# EAGLE design f4mpac (EAGLE 7.5.0)
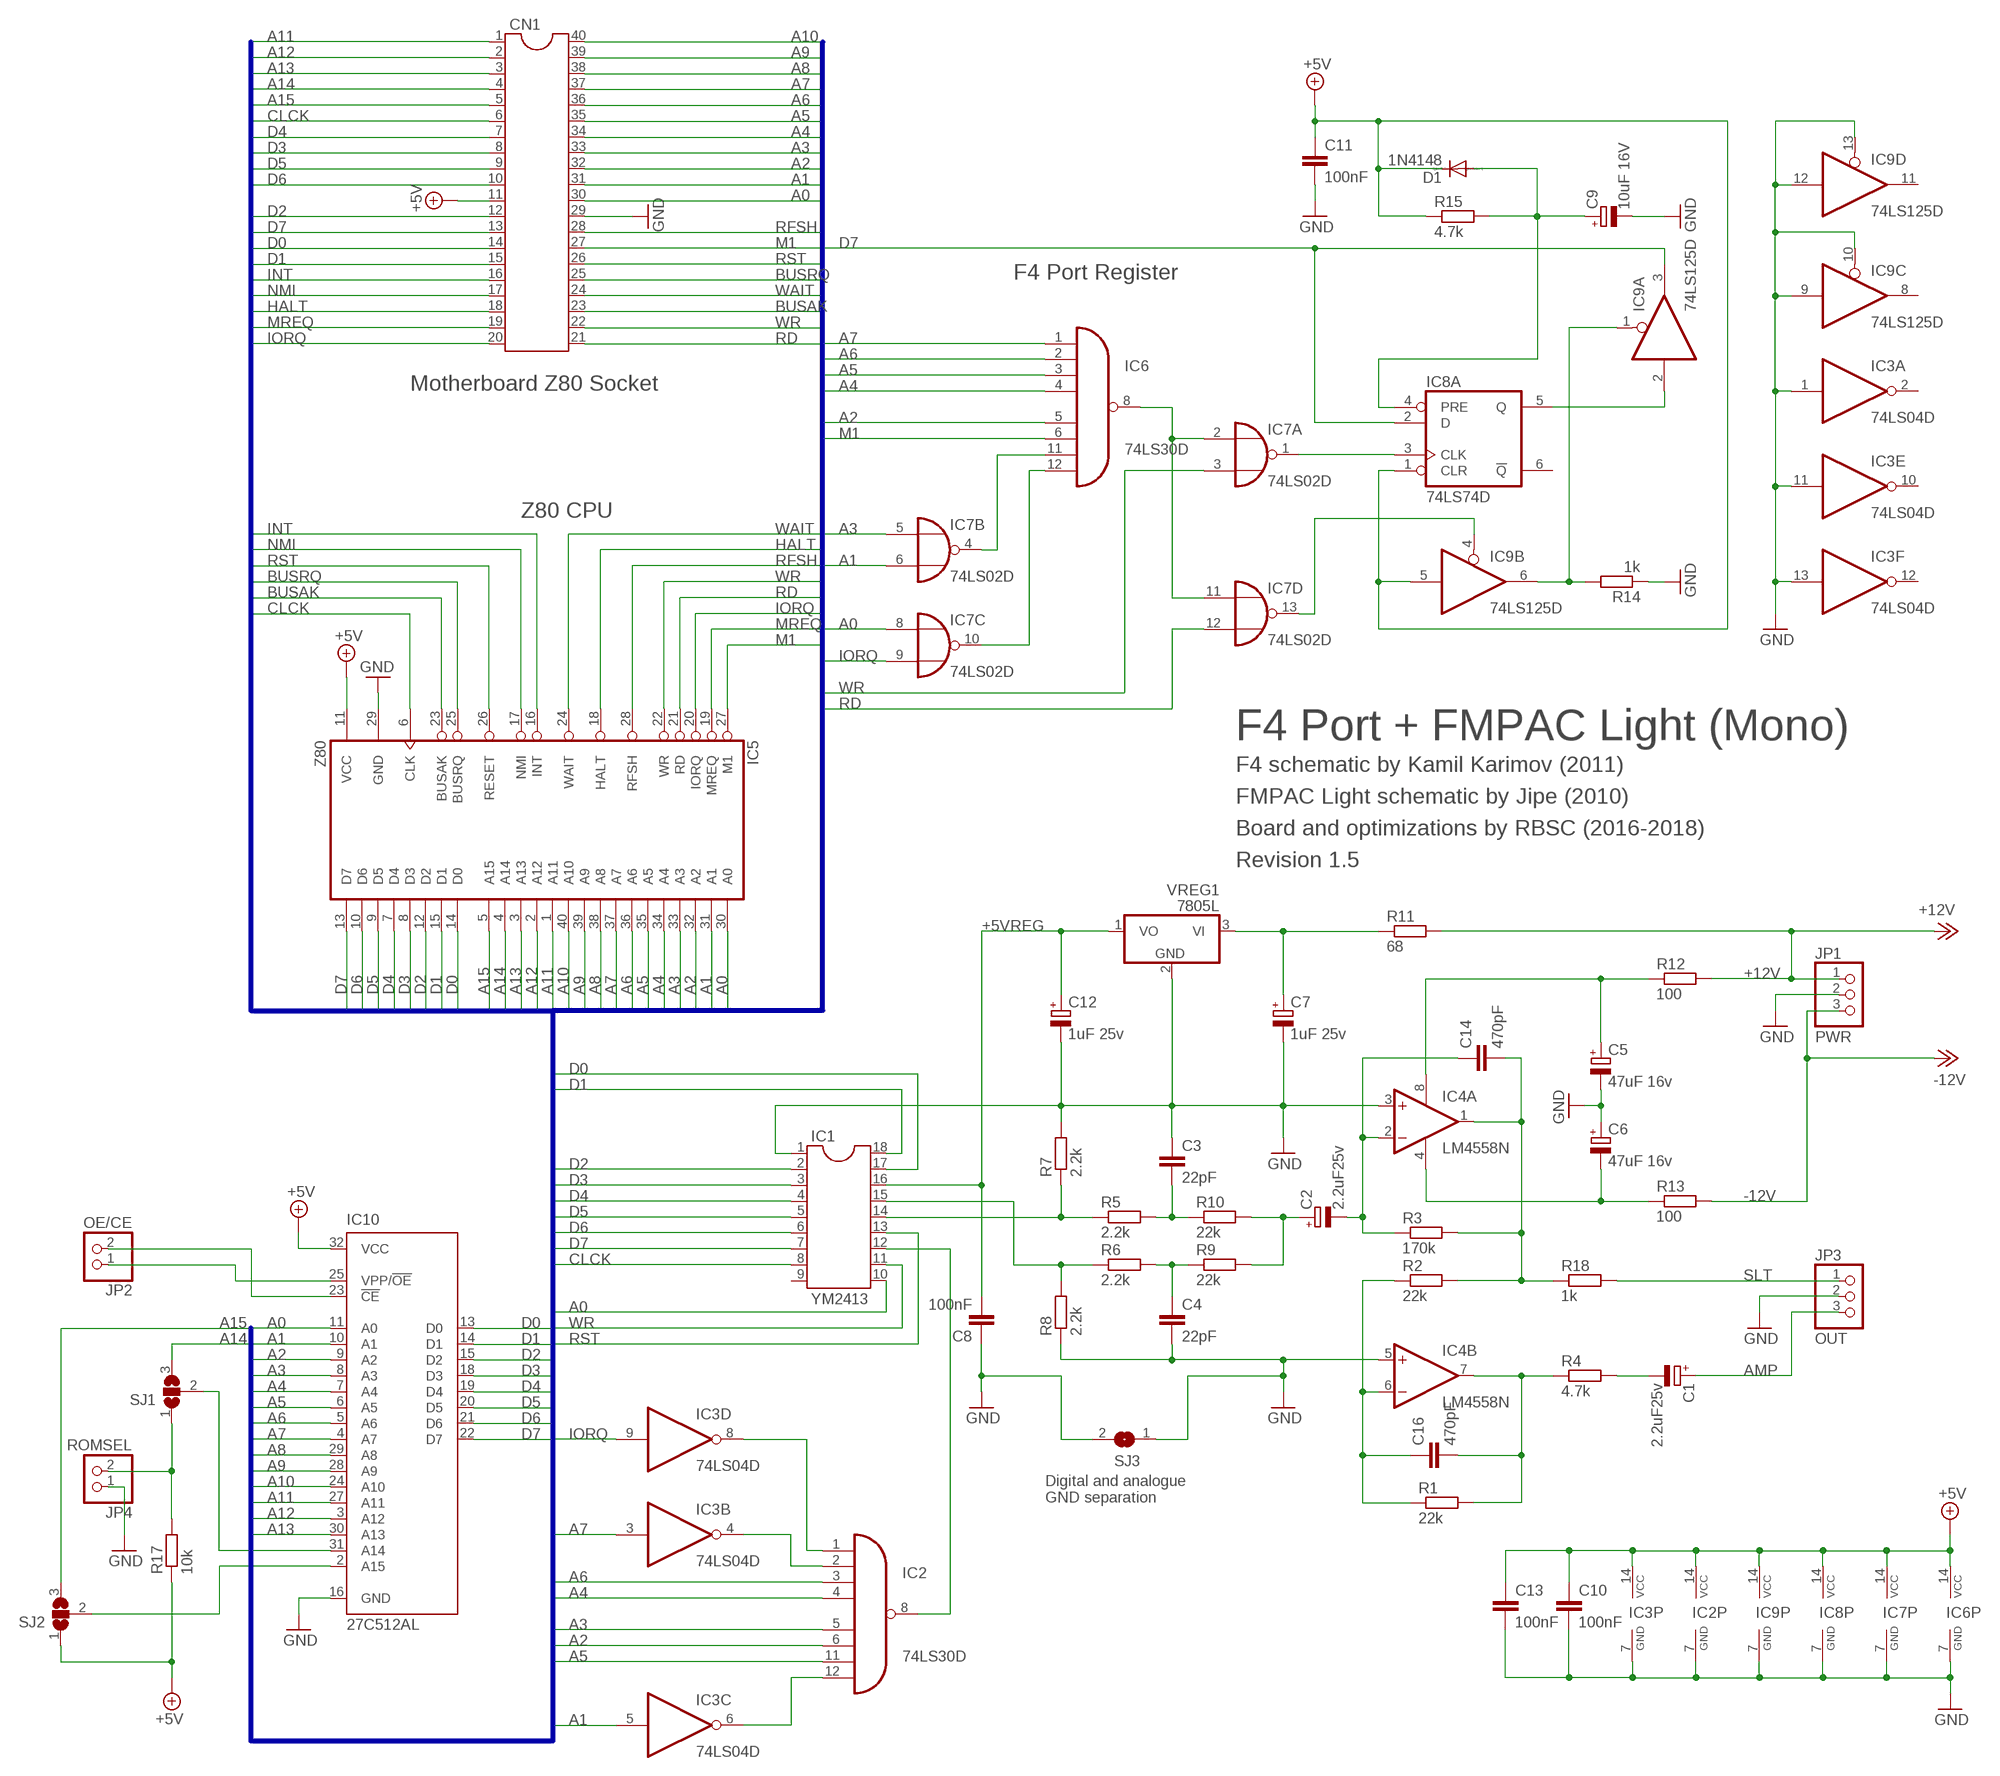
[diagram p0: schematic, sheet 1]

## Parts
C1  2.2uF25v  CPOL-EUSMCB  [SMC_B]
C2  2.2uF25v  CPOL-EUSMCB  [SMC_B]
C3  22pF  C-EUC0805  [C0805]
C4  22pF  C-EUC0805  [C0805]
C5  47uF 16v  CPOL-EUSMCC  [SMC_C]
C6  47uF 16v  CPOL-EUSMCC  [SMC_C]
C7  1uF 25v  CPOL-EUSMCB  [SMC_B]
C8  100nF  C-EUC0805  [C0805]
C9  10uF 16V  CPOL-EUSMCB  [SMC_B]
C10  100nF  C-EUC0805  [C0805]
C11  100nF  C-EUC0805  [C0805]
C12  1uF 25v  CPOL-EUSMCB  [SMC_B]
C13  100nF  C-EUC0805  [C0805]
C14  470pF  C-EUC0805  [C0805]
C16  470pF  C-EUC0805  [C0805]
CN1  DIP40 MB CONN  DIL40  [DIL40]
D1  1N4148  DIODE-MINIMELF  [MINIMELF]
IC1  YM2413  DIL18  [DIL18]
IC2  74LS30D  [SO14]
IC3  74LS04D  [SO14]
IC4  LM4558N  [DIL08]
IC5  Z80  Z80CPU  [DIL40]
IC6  74LS30D  [SO14]
IC7  74LS02D  [SO14]
IC8  74LS74D  [SO14]
IC9  74LS125D  [SO14]
IC10  27C512AL  [PLCC-32]
JP1  PWR  PINHD-1X3/90  [1X03/90]
JP2  OE/CE  PINHD-1X2/90  [1X02/90]
JP3  OUT  PINHD-1X3/90  [1X03/90]
JP4  ROMSEL  PINHD-1X2/90  [1X02/90]
R1  22k  R-EU_R0805  [R0805]
R2  22k  R-EU_R0805  [R0805]
R3  170k  R-EU_R0805  [R0805]
R4  4.7k  R-EU_R0805  [R0805]
R5  2.2k  R-EU_R0805  [R0805]
R6  2.2k  R-EU_R0805  [R0805]
R7  2.2k  R-EU_R0805  [R0805]
R8  2.2k  R-EU_R0805  [R0805]
R9  22k  R-EU_R0805  [R0805]
R10  22k  R-EU_R0805  [R0805]
R11  68  R-EU_R0805  [R0805]
R12  100  R-EU_R0805  [R0805]
R13  100  R-EU_R0805  [R0805]
R14  1k  R-EU_R0805  [R0805]
R15  4.7k  R-EU_M0805  [M0805]
R17  10k  R-EU_R0805  [R0805]
R18  1k  R-EU_R0805  [R0805]
SJ1  SJ2W  [SJ_2]
SJ2  SJ2W  [SJ_2]
SJ3  SJ  [SJ]
VREG1  7805L  [TO92]

## Nets
+5V: C10.1 C11.1 C13.1 CN1.11 D1.C IC2.14(VCC) IC3.14(P:VCC) IC5.11(VCC) IC6.14(VCC) IC7.14(P:VCC) IC8.1(A:CLR) IC8.14(P:VCC) IC9.5(B:I) IC9.14(P:VCC) IC10.32(VCC) R15.1 R17.1 SJ2.1
+5VREG: C8.2 C12.+ IC1.16 VREG1.1(VO)
+12V: JP1.1 R11.2 R12.2
+12VAMP: C5.+ IC4.8(P:V+) R12.1
-12V: JP1.3 R13.2
-12VAMP: C6.- IC4.4(P:V-) R13.1
A0: CN1.30 IC1.10 IC5.30(A0) IC7.8(C:I0) IC10.11(A0)
A1: CN1.31 IC3.5(C:I) IC5.31(A1) IC7.6(B:I1) IC10.10(A1)
A2: CN1.32 IC2.6(I5) IC5.32(A2) IC6.5(I4) IC10.9(A2)
A3: CN1.33 IC2.5(I4) IC5.33(A3) IC7.5(B:I0) IC10.8(A3)
A4: CN1.34 IC2.4(I3) IC5.34(A4) IC6.4(I3) IC10.7(A4)
A5: CN1.35 IC2.11(I6) IC5.35(A5) IC6.3(I2) IC10.6(A5)
A6: CN1.36 IC2.3(I2) IC5.36(A6) IC6.2(I1) IC10.5(A6)
A7: CN1.37 IC3.3(B:I) IC5.37(A7) IC6.1(I0) IC10.4(A7)
A8: CN1.38 IC5.38(A8) IC10.29(A8)
A9: CN1.39 IC5.39(A9) IC10.28(A9)
A10: CN1.40 IC5.40(A10) IC10.24(A10)
A11: CN1.1 IC5.1(A11) IC10.27(A11)
A12: CN1.2 IC5.2(A12) IC10.3(A12)
A13: CN1.3 IC5.3(A13) IC10.30(A13)
A14: CN1.4 IC5.4(A14) SJ1.3
A15: CN1.5 IC5.5(A15) SJ2.3
AMP: C1.+ JP3.3
BUSAK: CN1.23 IC5.23(BUSAK)
BUSRQ: CN1.25 IC5.25(BUSRQ)
CLCK: CN1.6 IC1.8 IC5.6(CLK)
D0: CN1.14 IC1.17 IC5.14(D0) IC10.13(D0)
D1: CN1.15 IC1.18 IC5.15(D1) IC10.14(D1)
D2: CN1.12 IC1.2 IC5.12(D2) IC10.15(D2)
D3: CN1.8 IC1.3 IC5.8(D3) IC10.18(D3)
D4: CN1.7 IC1.4 IC5.7(D4) IC10.19(D4)
D5: CN1.9 IC1.5 IC5.9(D5) IC10.20(D5)
D6: CN1.10 IC1.6 IC5.10(D6) IC10.21(D6)
D7: CN1.13 IC1.7 IC5.13(D7) IC8.2(A:D) IC9.3(A:O) IC10.22(D7)
GND: C3.1 C4.2 C5.- C6.+ C7.- C8.1 C9.- C10.2 C11.2 C12.- C13.2 CN1.29 IC1.1 IC2.7(GND) IC3.1(A:I) IC3.7(P:GND) IC3.11(E:I) IC3.13(F:I) IC4.3(A:+IN) IC4.5(B:+IN) IC5.29(GND) IC6.7(GND) IC7.7(P:GND) IC8.7(P:GND) IC9.7(P:GND) IC9.9(C:I) IC9.10(C:OE) IC9.12(D:I) IC9.13(D:OE) IC10.16(GND) JP1.2 JP3.2 JP4.1 R7.2 R8.1 R14.1 SJ3.1 SJ3.2 VREG1.2(GND)
HALT: CN1.18 IC5.18(HALT)
INT: CN1.16 IC5.16(INT)
IORQ: CN1.20 IC3.9(D:I) IC5.20(IORQ) IC7.9(C:I1)
M1: CN1.27 IC5.27(M1) IC6.6(I5)
MREQ: CN1.19 IC5.19(MREQ)
N$1: IC1.12 IC2.8(O)
N$2: IC10.31(A14) SJ1.2
N$3: C7.+ R11.1 VREG1.3(VI)
N$6: IC1.14 R5.1 R7.1
N$7: C2.- C14.1 IC4.2(A:-IN) R3.1
N$9: C16.1 IC4.6(B:-IN) R1.1 R2.1
N$11: C1.- R4.2
N$12: C3.2 R5.2 R10.1
N$13: IC1.15 R6.1 R8.2
N$14: C4.1 R6.2 R9.1
N$15: IC2.12(I7) IC3.6(C:O)
N$16: C2.+ R9.2 R10.2
N$17: IC2.2(I1) IC3.4(B:O)
N$18: IC2.1(I0) IC3.8(D:O)
N$19: C9.+ D1.A IC8.4(A:PRE) R15.2
N$20: IC10.25(VPP/!OE) JP2.1
N$21: IC10.23(!CE) JP2.2
N$22: JP4.2 R17.2 SJ1.1
N$24: IC6.11(I6) IC7.4(B:O)
N$25: IC10.2(A15) SJ2.2
N$27: C16.2 IC4.7(B:OUT) R1.2 R4.1
N$30: IC6.12(I7) IC7.10(C:O)
N$31: IC7.1(A:O) IC8.3(A:CLK)
N$32: IC7.13(D:O) IC9.4(B:OE)
N$33: IC6.8(O) IC7.2(A:I0) IC7.11(D:I0)
N$38: IC9.1(A:OE) IC9.6(B:O) R14.2
N$40: C14.2 IC4.1(A:OUT) R2.2 R3.2 R18.1
N$41: IC8.5(A:Q) IC9.2(A:I)
NMI: CN1.17 IC5.17(NMI)
RD: CN1.21 IC5.21(RD) IC7.12(D:I1)
RFSH: CN1.28 IC5.28(RFSH)
RST: CN1.26 IC1.13 IC5.26(RESET)
SLT: JP3.1 R18.2
WAIT: CN1.24 IC5.24(WAIT)
WR: CN1.22 IC1.11 IC5.22(WR) IC7.3(A:I1)
Unconnected: IC1.9 IC3.2(A:O) IC3.10(E:O) IC3.12(F:O) IC8.6(A:!Q) IC8.8(B:!Q) IC8.9(B:Q) IC8.10(B:PRE) IC8.11(B:CLK) IC8.12(B:D) IC8.13(B:CLR) IC9.8(C:O) IC9.11(D:O)

## Buses
A0,A1,A2,A3,A4,A5,A6,A7,A8,A9,A10,A11,A12,A13,A14,A15,D0,D1,D2,D3,D4,D5,D6,D7,IORQ,RD,WR,M1,CLCK,RST,RFSH,BUSRQ,WAIT,BUSAK,MREQ,HALT,INT,NMI

## Notes on the sheet
- F4 Port Register
- Motherboard Z80 Socket
- Z80 CPU
- F4 Port + FMPAC Light (Mono)
- F4 schematic by Kamil Karimov (2011)
- FMPAC Light schematic by Jipe (2010)
- Board and optimizations by RBSC (2016-2018)
- Revision 1.5
- Digital and analogue
  GND separation

## Library data of the parts
C1 C2 C5-C7 C9 C12 = rcl:CPOL-EU: POLARIZED CAPACITOR, European symbol
C3 C4 C8 C10 C11 C13 C14 C16 = rcl:C-EU: CAPACITOR, European symbol
CN1 = ic-package:DIL40: Dual In Line
D1 = diode:DIODE-: DIODE
IC1 = ic-package:DIL18: Dual In Line / Socket
IC2 IC6 = 74xx-eu:74*30: 8-input NAND gate
IC3 = 74xx-eu:74*04: Hex INVERTER
IC4 = linear:*4558: OP AMP
IC5 = zilog:Z80CPU: Z80 FAMILY DEVICE
IC7 = 74xx-eu:74*02: Quad 2-input NOR gate
IC8 = 74xx-eu:74*74: Dual D type positive edge triggered FLIP FLOP, preset and clear
IC9 = 74xx-eu:74*125: Quad bus BUFFER, 3-state
IC10 = microchip:27*512A: CMOS EPROM 512 K (64 K x 8); MPN: M27C512-90C1; OC_FARNELL: 1218315; OC_NEWARK: 24M5090
JP1 JP3 = pinhead:PINHD-1X3: PIN HEADER
JP2 JP4 = pinhead:PINHD-1X2: PIN HEADER
R1-R15 R17 R18 = rcl:R-EU_: RESISTOR, European symbol
SJ1 SJ2 = jumper:SJ2W: SMD solder JUMPER
SJ3 = jumper:SJ: SMD solder JUMPER
VREG1 = linear:78*: Positive VOLTAGE REGULATOR Source: http://cache.national.com/ds/LM/LM78L05.pdf http://www.fairchildsemi.com/ds/LM/LM7805.pdf

## Board
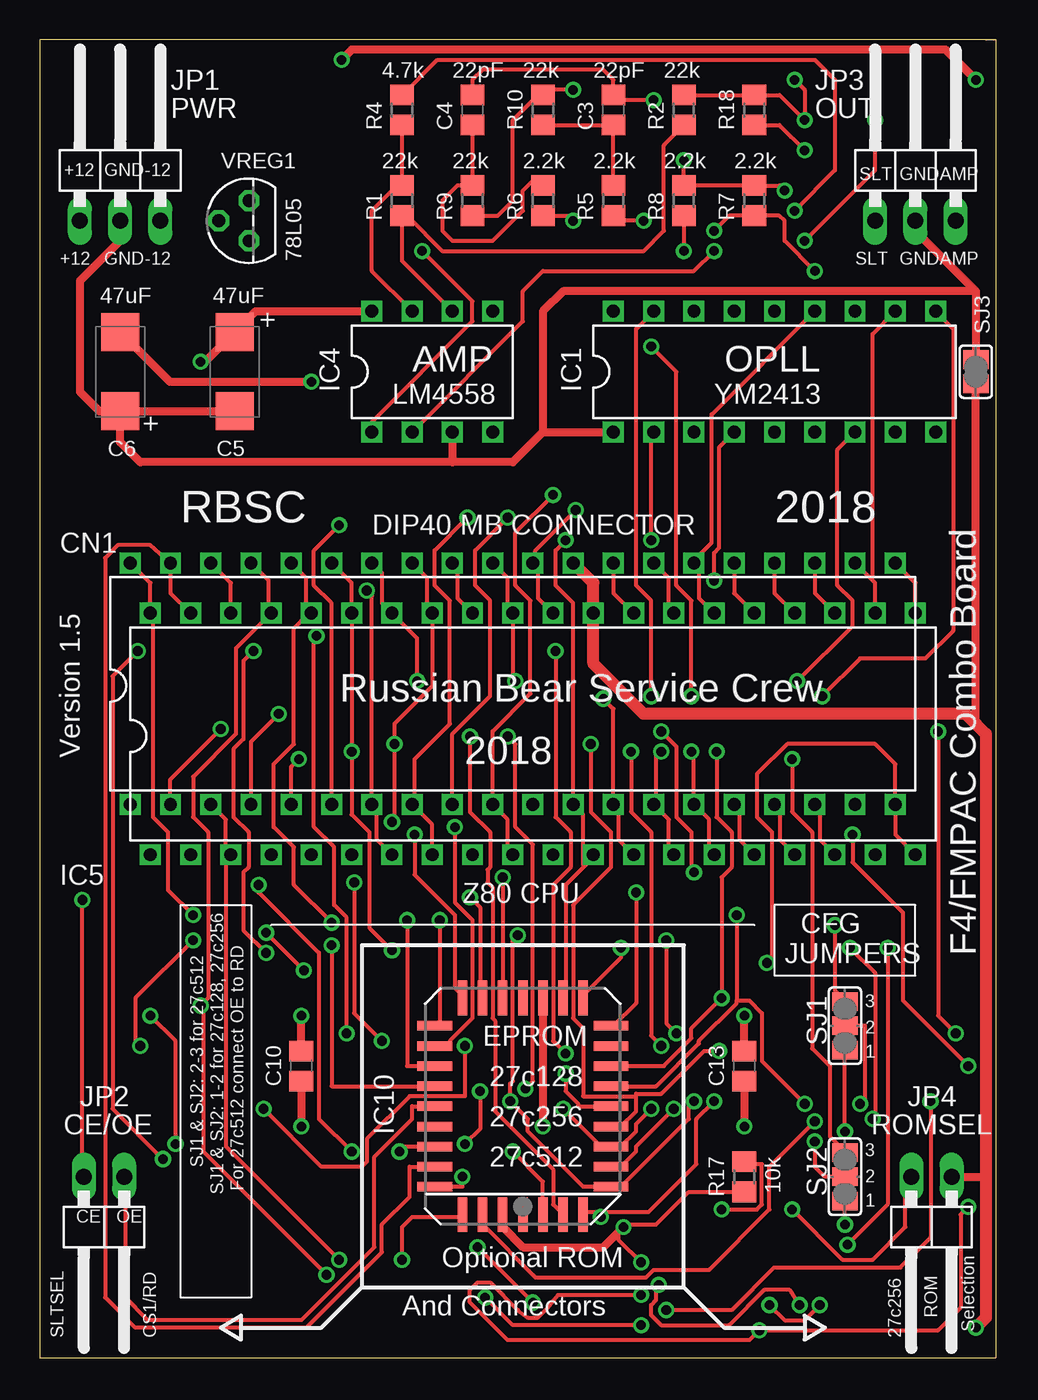
[diagram p1: board, top side]
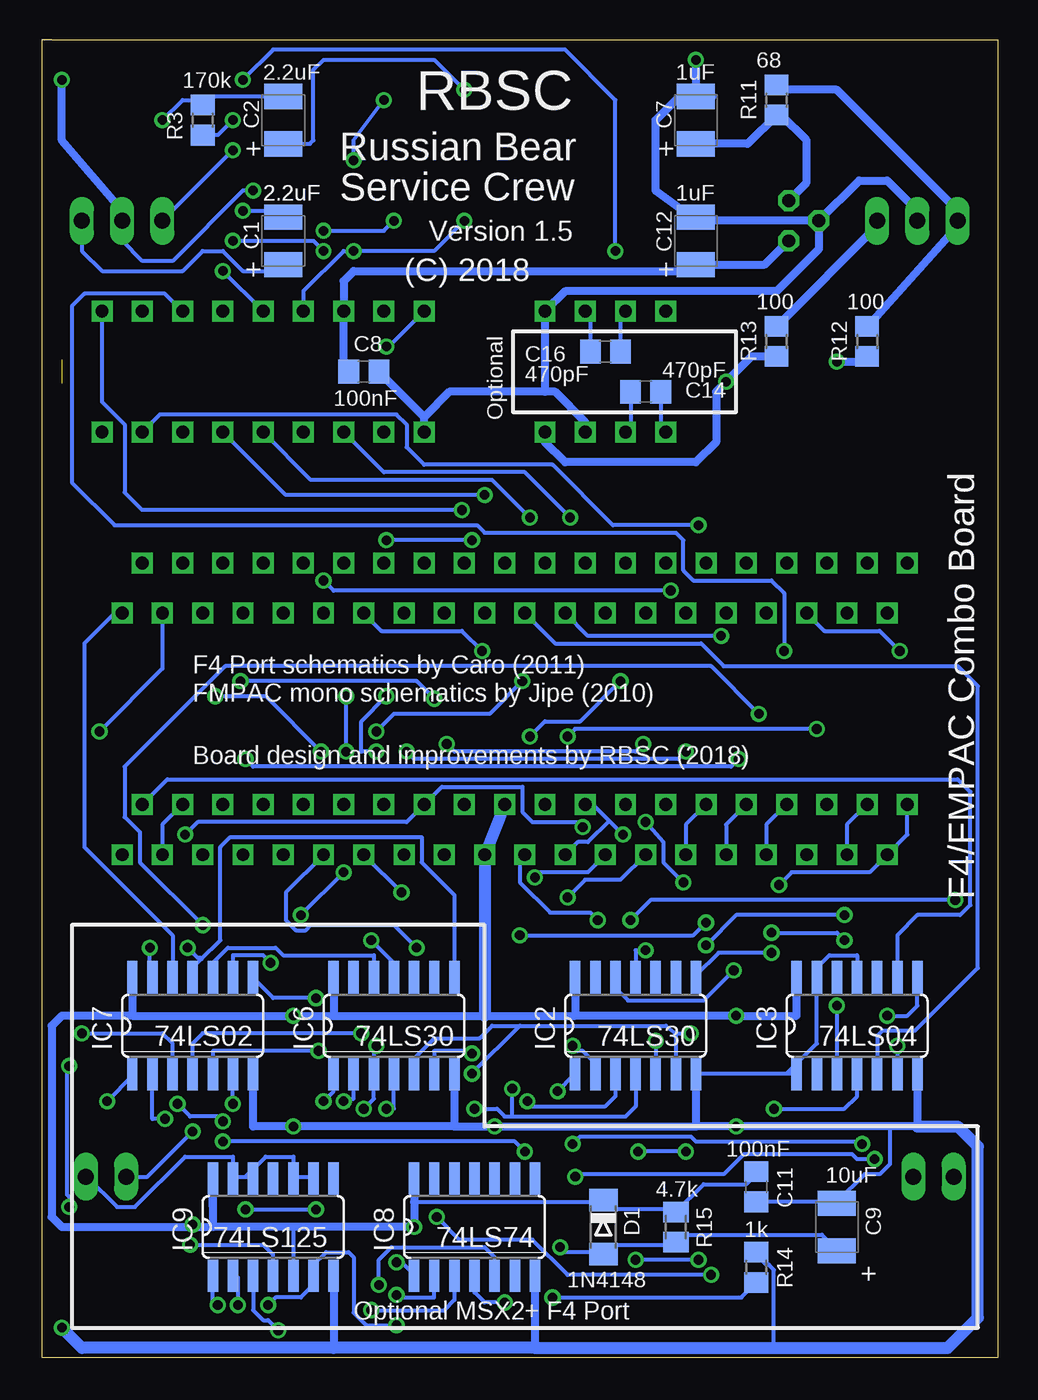
[diagram p2: board, bottom side, seen from below]

Size 60.33 x 83.19 mm. Coordinates in mm from the lower left corner, seen from the top.
Outline: 60.33,83.18 0,83.18 0,0 60.33,0 60.33,83.18
Outline: 59.69,83.19 60.33,83.18
Copper layers (1*16): Top 0.035mm / dielectric 1.5mm / Bottom 0.035mm
Design rules "default *": minimum track width 10mil, minimum drill 24mil, track to track 8mil, track to pad 8mil, pad to pad 8mil, via to via 8mil, smd to smd 8mil, copper to edge 8mil, drill to drill 8mil, minimum pad ring 10mil, minimum via ring 8mil, stop-mask expansion 4mil, vias tented up to drill 24mil, thermal gap 10mil

### Footprints (pad centres in the part's own frame; a part is rotated, then mirrored left to right if it is on the bottom)
SMC_B = smd 1.6 x 2.4: + -1.5,0; - 1.5,0
C0805 = smd 1.3 x 1.5: 1 -0.95,0; 2 0.95,0
SMC_C = smd 2.4 x 2.4: + -2.5,0; - 2.5,0
DIL40 = drill 0.813 square: 1 -24.13,-7.62; 2 -21.59,-7.62; 3 -19.05,-7.62; 4 -16.51,-7.62; 5 -13.97,-7.62; 6 -11.43,-7.62; 7 -8.89,-7.62; 8 -6.35,-7.62; 9 -3.81,-7.62; 10 -1.27,-7.62; 11 1.27,-7.62; 12 3.81,-7.62; 13 6.35,-7.62; 14 8.89,-7.62; 15 11.43,-7.62; 16 13.97,-7.62; 17 16.51,-7.62; 18 19.05,-7.62; 19 21.59,-7.62; 20 24.13,-7.62; 21 24.13,7.62; 22 21.59,7.62; 23 19.05,7.62; 24 16.51,7.62; 25 13.97,7.62; 26 11.43,7.62; 27 8.89,7.62; 28 6.35,7.62; 29 3.81,7.62; 30 1.27,7.62; 31 -1.27,7.62; 32 -3.81,7.62; 33 -6.35,7.62; 34 -8.89,7.62; 35 -11.43,7.62; 36 -13.97,7.62; 37 -16.51,7.62; 38 -19.05,7.62; 39 -21.59,7.62; 40 -24.13,7.62
MINIMELF = smd 1.4 x 1.8: A 1.7,0; C -1.7,0
DIL18 = drill 0.813 square: 1 -10.16,-3.81; 2 -7.62,-3.81; 3 -5.08,-3.81; 4 -2.54,-3.81; 5 0,-3.81; 6 2.54,-3.81; 7 5.08,-3.81; 8 7.62,-3.81; 9 10.16,-3.81; 10 10.16,3.81; 11 7.62,3.81; 12 5.08,3.81; 13 2.54,3.81; 14 0,3.81; 15 -2.54,3.81; 16 -5.08,3.81; 17 -7.62,3.81; 18 -10.16,3.81
SO14 = smd 0.66 x 2.032: 1 -3.81,-3.073; 2 -2.54,-3.073; 3 -1.27,-3.073; 4 0,-3.073; 5 1.27,-3.073; 6 2.54,-3.073; 7 3.81,-3.073; 8 3.81,3.073; 9 2.54,3.073; 10 1.27,3.073; 11 0,3.073; 12 -1.27,3.073; 13 -2.54,3.073; 14 -3.81,3.073
DIL08 = drill 0.813 pad 1.27 square: 1 -3.81,-3.81; 2 -1.27,-3.81; 3 1.27,-3.81; 4 3.81,-3.81; 5 3.81,3.81; 6 1.27,3.81; 7 -1.27,3.81; 8 -3.81,3.81
PLCC-32 = smd 2.2 x 0.6: 1 -6.83,0; 2 -6.83,-1.27; 3 -6.83,-2.54; 4 -6.83,-3.81; 14 6.83,-3.81; 15 6.83,-2.54; 16 6.83,-1.27; 17 6.83,0; 18 6.83,1.27; 19 6.83,2.54; 20 6.83,3.81; 30 -6.83,3.81; 31 -6.83,2.54; 32 -6.83,1.27 | smd 0.6 x 2.2: 5 -5.08,-5.56; 6 -3.81,-5.56; 7 -2.54,-5.56; 8 -1.27,-5.56; 9 0,-5.56; 10 1.27,-5.56; 11 2.54,-5.56; 12 3.81,-5.56; 13 5.08,-5.56; 21 5.08,5.56; 22 3.81,5.56; 23 2.54,5.56; 24 1.27,5.56; 25 0,5.56; 26 -1.27,5.56; 27 -2.54,5.56; 28 -3.81,5.56; 29 -5.08,5.56
1X03/90 = drill 1.016 long: 1 -2.54,-3.81; 2 0,-3.81; 3 2.54,-3.81
1X02/90 = drill 1.016 long: 1 -1.27,-3.81; 2 1.27,-3.81
R0805 = smd 1.3 x 1.5: 1 -0.95,0; 2 0.95,0
M0805 = smd 1.3 x 1.6: 1 -0.95,0; 2 0.95,0
SJ_2 = smd 1.168 x 1.6: 1 -1.524,0; 2 0,0; 3 1.524,0
SJ = smd 1.168 x 1.6: 1 -0.762,0; 2 0.762,0
TO92 = drill 0.813 octagon: 1 -1.27,0; 2 0,1.905; 3 1.27,0

### Placement (x,y rotation side)
C1  45.09,70.48 90 bottom
C2  45.09,78.11 90 bottom
C3  36.2,78.74 270 top
C4  27.3,78.74 90 top
C5  12.32,62.23 270 top
C6  5.08,62.23 90 top
C7  19.05,78.11 90 bottom
C8  40.01,62.23 180 bottom
C9  10.16,8.26 90 bottom
C10  16.51,18.42 270 top
C11  15.24,10.79 270 bottom
C12  19.05,70.48 90 bottom
C13  44.45,18.42 270 top
C14  22.23,60.96 0 bottom
C16  24.77,63.5 0 bottom
CN1  29.84,42.54 0 top
D1  24.89,8.26 270 bottom
IC1  46.35,62.23 0 top
IC2  22.86,20.96 0 bottom
IC3  8.89,20.96 0 bottom
IC4  24.77,62.23 0 top
IC5  31.11,39.37 0 top
IC6  38.1,20.96 0 bottom
IC7  50.8,20.96 0 bottom
IC8  33.02,8.26 0 bottom
IC9  45.72,8.26 0 bottom
IC10  30.48,15.88 90 top
JP1  5.08,75.57 0 top
JP2  4.06,7.62 180 top
JP3  55.24,75.57 0 top
JP4  56.26,7.62 180 top
R1  22.86,73.03 90 top
R2  40.64,78.74 90 top
R3  50.16,78.11 270 bottom
R4  22.86,78.74 90 top
R5  36.2,73.03 90 top
R6  31.75,73.03 90 top
R7  45.09,73.03 90 top
R8  40.64,73.03 270 top
R9  27.3,73.03 270 top
R10  31.75,78.74 90 top
R11  13.97,79.38 90 bottom
R12  8.26,64.14 90 bottom
R13  13.97,64.14 90 bottom
R14  15.24,5.71 270 bottom
R15  20.32,8.26 270 bottom
R17  44.45,11.43 90 top
R18  45.09,78.74 270 top
SJ1  50.8,20.96 90 top
SJ2  50.8,11.43 90 top
SJ3  59.05,62.23 270 top
VREG1  13.21,71.76 90 top

### Tracks (layer width: path | path; a pad name or v marks a point on that pad's centre or on a via)
+5V  (via drill 0.6, 0.61)
  Top 0.254: R17.1 40.96,10.48 38.89,8.41 36.99,8.41 v36.83,8.26 | v50.8,8.41 SJ2.1 | v37.94,6.03 36.51,7.46 36.51,7.62 36.35,7.78
  Top 0.508: IC10.32 29.21,8.26 30.48,6.98 35.56,6.98 36.35,7.78 v36.83,8.26 | C10.1 v16.51,21.59 | C13.1 v44.45,21.59
  Bottom 0.254: C11.1 15.24,11.59 15.88,10.95 18.57,10.95 R15.1 20.32,9.37 24.29,9.37 24.77,9.84 D1.C 24.92,9.84 36.83,9.84 | v50.8,8.41 50.8,8.26 | v37.94,6.03 37.62,6.03 36.83,5.24 IC8.1 | 44.45,8.26 IC9.5
  Bottom 0.508: IC6.14 41.91,21.59 | IC7.14 54.61,21.59 | 54.61,21.59 v44.45,21.59 41.91,21.59 | IC8.14 36.83,9.84 v36.83,8.26 44.45,8.26 49.53,8.26 | 49.53,9.53 IC9.14 49.53,8.26 | 26.67,21.59 v16.51,21.59 12.7,21.59 IC3.14 | IC2.14 26.67,21.59 | 49.53,8.26 50.8,8.26 59.05,8.26 59.69,8.89 59.69,20.96 59.05,21.59 54.61,21.59 | 41.91,21.59 32.38,21.59 26.67,21.59
  Bottom 0.762: CN1.11 IC5.11 32.38,21.59
+5VREG
  Bottom 0.508: C8.2 41.27,62.55 IC1.16 41.27,67.95 40.64,68.58 19.91,68.58 C12.+ 14.71,68.98 VREG1.1
+12V
  Bottom 0.508: R12.2 2.54,71.44 JP1.1 2.54,72.39 10.16,80.01 13.65,80.01 R11.2
+12VAMP  (via drill 0.6)
  Top 0.508: IC4.8 13.63,66.04 C5.+ 10.45,62.86 v10.16,62.86
  Bottom 0.254: R12.1 8.26,62.86
  Bottom 0.508: v10.16,62.86 8.26,62.86
-12V
  Bottom 0.508: JP1.3 7.62,71.44 R13.2
-12VAMP  (via drill 0.6)
  Top 0.508: C6.- 8.21,61.59 v17.14,61.59
  Bottom 0.508: R13.1 15.55,63.18 v17.14,61.59 17.78,60.96 17.78,57.78 19.05,56.52 27.3,56.52 28.57,57.78 IC4.4
A0  (via drill 0.61)
  Top 0.254: IC10.11 39.37,18.42 41.12,20.16 41.12,20.8 v43.02,22.7 43.02,30.32 43.66,30.96 43.66,33.18 42.7,34.13 v42.7,38.26 | IC5.30 31.43,47.94 31.43,49.85 CN1.30 31.27,50.16 31.27,50.96 v33.81,53.5 | v49.37,41.75 51.75,44.13 55.88,44.13 57.63,45.88 57.63,64.93 IC1.10
  Bottom 0.254: v43.02,22.7 45.72,22.7 46.99,23.97 IC7.8 | IC1.10 56.52,60.32 55.09,58.9 55.09,54.61 53.98,53.5 v33.81,53.5 | v42.7,38.26 46.2,41.75 v49.37,41.75
A1  (via drill 0.61)
  Top 0.254: v48.26,16.03 45.56,18.73 45.56,21.75 44.77,22.54 43.97,22.54 | 43.97,22.54 43.97,22.38 41.59,20 41.59,19.84 38.89,17.15 IC10.10 | CN1.31 29.53,49.21 29.53,47.31 IC5.31 29.84,42.86 v30,42.7 | v43.97,27.94 43.97,22.54 | v41.27,30.64 41.12,30.8 41.12,33.18 40.16,34.13 40.16,38.58 v39.21,39.53
  Bottom 0.254: v48.26,16.03 IC7.6 | IC3.5 7.62,20.32 7.3,20.64 5.24,20.64 1.27,24.61 1.27,42.39 2.54,43.66 17.3,43.66 18.73,45.09 27.94,45.09 IC5.31 | v41.27,30.64 v43.97,27.94 | v39.21,39.53 38.1,40.64 32.07,40.64 v30,42.7
A2  (via drill 0.61)
  Top 0.254: IC5.32 26.35,47.94 26.35,49.85 CN1.32 | IC10.9 33.97,15.88 33.97,16.03 33.18,16.83 v33.18,17.94 | v17.46,45.56 17.3,45.4 17.3,33.5 18.57,32.23 18.57,28.58 19.37,27.78 v19.37,20.48
  Bottom 0.254: 20.32,20.48 20.95,20.96 30.16,20.96 | 20.32,20.48 IC2.6 | 30.16,20.96 31.91,20.96 32.7,20.16 35.56,20.16 36.83,18.89 IC6.5 | 30.16,20.96 v33.18,17.94 | IC5.32 25.88,45.56 v17.46,45.56 | 20.32,20.48 v19.37,20.48
A3  (via drill 0.61)
  Top 0.254: v42.86,19.37 41.91,19.37 39.21,16.67 37.62,16.67 37.62,16.51 | 37.62,16.51 37.62,15.56 36.67,14.61 IC10.8 | v21.59,20 19.84,21.75 v19.84,30 | v22.23,33.81 22.38,33.97 v22.38,38.73 22.38,40 24.77,42.39 IC5.33 24.45,47.31 24.45,49.21 CN1.33 | 37.62,16.51 34.29,16.51 34.29,20.8 33.66,21.43 33.66,28.58 36.04,30.96 36.04,33.18 34.77,34.45 v34.77,38.73
  Bottom 0.254: IC7.5 49.53,19.37 v42.86,19.37 | v21.59,20 IC2.5 | v19.84,30 21.11,31.27 21.11,32.54 v22.23,33.81 | v34.77,38.73 34.29,38.26 22.86,38.26 v22.38,38.73
A4  (via drill 0.61)
  Top 0.254: CN1.34 21.59,49.53 21.59,47.62 IC5.34 23.81,45.4 v23.81,42.7 | v33.02,15.72 35.4,13.33 IC10.7 36.67,13.33 37.62,14.29 37.62,14.76 v38.58,15.72 | v29.53,39.21 30,38.73 30,33.5 31.11,32.38 31.11,17.46 v30.64,16.99
  Bottom 0.254: 30.64,15.24 31.11,15.24 31.59,15.72 v33.02,15.72 | 30.64,15.24 23.5,15.24 22.86,15.88 IC2.4 | IC6.4 38.1,15.72 v38.58,15.72 | v23.81,42.7 26.35,40.16 28.57,40.16 v29.53,39.21 | 30.64,15.24 v30.64,16.99
A5  (via drill 0.61)
  Top 0.254: v40.01,15.72 37.62,13.33 37.62,13.02 36.67,12.06 IC10.6 | v22.23,25.72 20.8,27.15 20.8,33.18 19.68,34.29 v19.68,38.26 IC5.35 19.68,48.89 CN1.35 | v39.21,19.69 38.58,20.32 38.58,33.18 37.31,34.45 v37.31,38.26
  Bottom 0.254: v40.01,15.72 39.37,16.35 IC6.3 39.37,19.69 v39.21,19.69 | IC2.11 22.86,25.72 v22.23,25.72 | v37.31,38.26 36.83,37.78 20.16,37.78 v19.68,38.26
A6  (via drill 0.61)
  Top 0.254: CN1.36 16.83,49.21 16.83,47.31 IC5.36 16.99,46.99 16.03,46.04 16.03,38.73 14.76,37.46 14.76,33.5 16.03,32.23 16.03,29.85 v18.41,27.46 | v41.27,16.19 40.96,15.88 40.96,15.08 36.67,10.79 IC10.5 34.29,10.79 30.8,14.29 30.8,15.08 v29.69,16.19 29.69,17.3 29.84,17.46 29.84,26.35 v30.16,26.67
  Bottom 0.254: v29.69,16.19 29.37,15.88 24.77,15.88 24.13,16.51 IC2.3 | IC6.2 40.64,16.35 41.12,16.35 v41.27,16.19 | v18.41,27.46 19.21,26.67 v30.16,26.67
A7  (via drill 0.61)
  Top 0.254: v42.55,16.19 41.43,15.08 41.43,12.22 38.42,9.21 35.4,9.21 | 35.4,9.21 34.29,9.21 IC10.4 | CN1.37 14.45,49.05 14.45,46.99 IC5.37 12.38,44.77 12.38,39.37 9.68,36.67 9.68,34.13 10.64,33.18 10.64,22.7 v10.16,22.23 10.32,22.23 10.32,13.02 v18.1,5.24 | v35.4,8.89 35.4,9.21
  Bottom 0.254: IC6.1 41.91,16.83 v42.55,16.19 | v10.16,22.23 IC3.3 | v35.4,8.89 33.97,7.46 29.37,7.46 27.15,5.24 v18.1,5.24
A8  (via drill 0.61)
  Top 0.254: IC10.29 26.67,10.79 v26.67,11.43 | v7.78,12.54 4.6,15.72 4.6,43.02 v6.19,44.61 | CN1.38 12.06,48.89 IC5.38
  Bottom 0.254: v26.67,11.43 26.51,11.59 17.3,11.59 16.03,12.86 9.21,12.86 8.89,12.54 v7.78,12.54 | v6.19,44.61 7.46,45.88 10.95,45.88 IC5.38
A9
  Top 0.254: IC10.28 23.34,12.06 23.34,10.16 21.59,8.41 21.59,6.67 16.83,1.91 6.03,1.91 4.13,3.81 4.13,50.48 4.92,51.28 6.99,51.28 CN1.39 8.26,48.26 IC5.39
A10  (via drill 0.61)
  Top 0.254: IC10.24 18.41,17.15 v18.41,26.04 | v9.68,27.94 8.1,29.53 8.1,33.18 7.14,34.13 7.14,46.83 IC5.40 6.99,48.89 CN1.40
  Bottom 0.254: v18.41,26.04 16.51,27.94 v9.68,27.94
A11  (via drill 0.61)
  Top 0.254: IC10.27 22.7,13.33 v22.7,13.02 | v19.68,13.02 17.62,15.08 17.62,25.56 13.81,29.37 v13.81,29.85
  Bottom 0.254: v19.68,13.02 v22.7,13.02 | v13.81,29.85 13.02,30.64 8.1,30.64 IC5.1 5.71,33.02 CN1.1
A12  (via drill 0.61)
  Top 0.254: v27.15,39.21 27.15,34.45 28.42,33.18 28.42,30.96 28.26,30.8 28.26,30 28.57,29.69 28.57,21.43 28.73,21.27 28.73,15.56 32.38,11.91 32.38,9.68 IC10.3 | v11.43,39.69 8.26,36.51 CN1.2
  Bottom 0.254: v27.15,39.21 26.67,39.69 v11.43,39.69 | IC5.2 9.53,33.66 CN1.2
A13  (via drill 0.61)
  Top 0.254: v22.86,6.19 22.86,8.26 23.5,8.89 26.67,8.89 IC10.30 | v18.89,6.19 11.75,13.33 11.75,31.43 IC5.3 11.75,31.59 11.75,33.97 CN1.3
  Bottom 0.254: v18.89,6.19 v22.86,6.19
A14  (via drill 0.61)
  Top 0.254: v50.16,27.31 50.16,23.18 50.8,22.54 SJ1.3 | v15.08,40.64 13.34,38.89 CN1.4
  Bottom 0.254: v50.16,27.31 54.13,31.27 54.13,33.18 55.09,34.13 55.09,37.31 48.74,43.66 18.1,43.66 v15.08,40.64 | IC5.4 14.61,33.66 CN1.4
A15  (via drill 0.61)
  Top 0.254: v47.47,37.78 47.47,34.45 48.74,33.18 48.74,19.53 49.85,18.42 49.85,13.97 50.8,13.02 SJ2.3 | v16.35,37.78 15.88,37.31 CN1.5
  Bottom 0.254: v47.47,37.78 46.99,37.31 16.83,37.31 v16.35,37.78 | IC5.5 17.14,33.66 CN1.5
AMP
  Bottom 0.254: JP3.3 57.78,69.85 56.52,68.58 51.44,68.58 50.16,69.85 48.9,69.85 47.62,68.58 45.49,68.58 C1.+ 45.31,69.22
BUSAK
  Top 0.254: IC5.23 48.9,48.26 CN1.23
BUSRQ
  Top 0.254: IC5.25 43.81,48.26 CN1.25
CLCK  (via drill 0.61)
  Top 0.254: v18.89,52.55 17.3,50.96 17.3,48.74 18.41,47.62 CN1.6
  Bottom 0.254: IC5.6 19.68,33.66 CN1.6 | IC1.8 52.86,59.53 37.94,59.53 37.31,58.9 37.31,57.47 36.2,56.36 28.1,56.36 24.29,52.55 v18.89,52.55
D0  (via drill 0.61)
  Top 0.254: v37.62,29.37 37.62,22.38 36.2,20.96 IC10.13 | IC5.14 39.69,32.07 39.69,33.97 CN1.14 38.89,34.92 38.89,37.94 v39.21,38.26 | IC1.17 37.62,64.93 37.62,48.74 38.58,47.78 v38.58,41.75
  Bottom 0.254: IC5.14 v37.62,29.37 | v38.58,41.75 40.16,40.16 40.16,38.26 v39.21,38.26
D1  (via drill 0.61)
  Top 0.254: v36.67,25.88 36.67,25.24 34.29,22.86 IC10.14 | IC5.15 42.23,32.07 42.23,33.97 CN1.15 41.27,38.1 v41.12,38.26 | v38.58,63.82 40.16,62.23 40.16,48.74 41.12,47.78 v41.12,41.75
  Bottom 0.254: v36.67,25.88 38.1,27.31 43.34,27.31 43.66,26.99 44.29,26.99 44.93,27.62 44.93,29.37 IC5.15 | IC1.18 38.42,63.82 v38.58,63.82 | v41.12,38.26 v41.12,41.75
D2  (via drill 0.61)
  Top 0.254: IC10.15 33.02,22.86 33.18,23.02 33.18,29.85 34.92,31.59 IC5.12 34.29,31.12 34.29,34.29 CN1.12 33.66,47.62 32.54,48.74 32.54,50.96 v33.18,51.59 | IC1.2 38.58,58.26 v38.58,51.59
  Bottom 0.254: v33.18,51.59 v38.58,51.59
D3  (via drill 0.61)
  Top 0.254: v29.21,30.32 IC10.18 | IC5.8 24.77,33.66 CN1.8 23.65,34.92 23.65,37.78 25.88,40 25.88,47.78 24.92,48.74 24.92,50.96 v26.99,53.02
  Bottom 0.254: v29.21,30.32 28.89,30.64 25.88,30.64 IC5.8 | IC1.3 38.73,55.88 29.84,55.88 v26.99,53.02
D4  (via drill 0.61)
  Top 0.254: v27.15,29.05 27.78,28.42 27.78,23.02 27.94,22.86 IC10.19 | IC5.7 21.27,32.7 21.27,34.61 CN1.7 20.95,48.1 v20.64,48.42 | IC1.4 42.86,57.47 42.86,51.12 42.55,50.8 v42.55,49.05
  Bottom 0.254: v27.15,29.05 26.04,30.16 23.81,30.16 IC5.7 | v42.55,49.05 41.91,48.42 v20.64,48.42
D5  (via drill 0.61)
  Top 0.254: v23.65,33.02 23.65,30.48 26.19,27.94 26.19,23.34 26.67,22.86 IC10.20 | v29.53,53.02 27.46,50.96 27.46,48.74 28.42,47.78 28.42,41.75 26.04,39.37 CN1.9
  Bottom 0.254: 24.53,33.89 25.56,34.92 CN1.9 | 24.53,33.89 v23.65,33.02 | IC5.9 26.51,32.54 25.88,32.54 24.53,33.89 | IC1.5 43.34,55.4 31.91,55.4 v29.53,53.02
D6  (via drill 0.61)
  Top 0.254: v25.24,27.62 25.24,21.27 IC10.21 | IC5.10 29.53,32.07 29.53,33.97 CN1.10 28.57,39.53 30.96,41.91 30.96,47.78 30,48.74 30,52.07 v32.38,54.45
  Bottom 0.254: v25.24,27.62 25.72,28.1 28.26,28.1 30.16,30 30.16,31.75 IC5.10 | IC1.6 44.93,54.45 v32.38,54.45
D7  (via drill 0.61)
  Top 0.254: v37.94,3.97 32.7,3.97 32.07,3.17 31.43,2.54 30.8,2.54 30.16,3.02 28.42,4.76 27.62,4.76 27.15,4.29 27.15,3.49 29.53,1.11 44.77,1.11 v45.4,1.75 56.67,1.75 58.1,3.17 58.1,9.05 v58.58,9.53 | IC10.22 25.88,19.69 25.88,20 27.3,21.43 27.3,27.62 26.19,28.73 v26.19,33.5 | IC5.13 36.51,32.7 36.51,34.61 CN1.13 36.2,40.96 v35.56,41.59 | IC1.7 50.32,57.31 50.32,48.74 51.28,47.78 51.28,46.2 v47.78,42.7 | v58.58,18.42 54.45,22.54 54.45,28.1 51.28,31.27 v51.28,33.02
  Bottom 0.254: IC8.2 35.56,3.81 37.78,3.81 v37.94,3.97 | v45.4,1.75 46.04,2.38 46.35,2.38 46.99,3.02 IC9.3 | v26.19,33.5 26.51,33.81 29.37,33.81 30,34.45 30,36.04 35.08,36.04 CN1.13 37.31,33.81 50.48,33.81 v51.28,33.02 | v47.78,42.7 36.67,42.7 v35.56,41.59 | v58.58,9.53 58.58,10.16 58.74,10.32 58.74,18.42 v58.58,18.42
GND  (via drill 0.6)  (2 unrouted)
  Top 0.254: C4.2 27.3,80.65 27.94,81.28 35.56,81.28 36.2,80.65 C3.1 36.51,79.38 v38.73,79.38 | v40.64,75.57 R8.1 R7.2 46.67,73.98 v46.99,73.66
  Top 0.508: C5.- C6.+ 3.77,59.73 2.54,60.96 2.54,67.95 5.08,70.48 JP1.2 | IC10.16 v31.75,14.61 | C10.2 v16.51,14.61 | C13.2 v44.45,14.61 | JP4.1 59.69,11.43 | v59.05,80.65 57.15,82.55 19.68,82.55 v19.05,81.92 | 59.05,67.31 33.02,67.31 31.75,66.04 31.75,58.42 | 31.75,58.42 29.84,56.52 26.04,56.52 | 26.04,56.52 6.35,56.52 5.08,57.78 5.08,59.69 | JP3.2 55.24,71.12 59.05,67.31 | IC4.3 26.04,56.52 | 31.75,58.42 IC1.1 | 59.05,67.31 SJ3.1 | 59.05,40 59.05,61.59
  Top 0.762: v59.05,1.91 59.69,2.54 59.69,11.43 59.69,39.37 59.05,40 58.42,40.64 38.1,40.64 34.92,43.81 IC5.29 34.92,48.89 CN1.29
  Bottom 0.254: v40.64,75.57 40.64,76.84 v38.73,79.38 | v46.99,73.66 47.62,73.66 52.07,69.22 53.98,69.22 55.24,70.48 JP3.2 | 10.16,9.84 C11.2 | 44.45,11.43 43.18,11.43 IC9.9 | 48.26,11.43 47.47,11.43 | 47.47,11.43 46.99,11.43 IC9.12 | 44.45,11.43 44.45,12.7 46.2,12.7 47.47,11.43 | 44.45,11.43 IC9.10 | IC3.11 8.89,25.4 10.64,25.4 11.43,24.61 IC3.13 11.43,19.84 13.34,17.94 | 14.13,0.64 14.13,5.56 14.45,5.87 14.61,5.87 15.24,6.51 R14.1 | 13.34,17.94 18.89,17.94 IC2.7 | 13.34,17.94 12.7,17.94 IC3.1 | 48.26,11.43 48.26,12.7 51.28,12.7 54.45,9.53 55.56,9.53 57.47,11.43 JP4.1 | 48.26,11.43 IC9.13 | 10.16,9.84 8.41,11.59 7.46,11.59 6.83,12.22 6.83,14.61 | 10.16,9.84 C9.-
  Bottom 0.508: VREG1.2 19.05,71.76 C12.- 19.28,71.98 21.59,73.66 21.59,78.11 19.57,80.12 C7.- 18.01,79.61 | IC1.1 36.2,59.37 | IC9.7 41.91,0.64 | IC8.7 29.21,0.64 | IC2.7 19.05,14.61 | 34.29,14.61 v31.75,14.61 | v31.75,14.61 19.05,14.61 | IC6.7 34.29,14.61 | 34.29,14.61 v44.45,14.61 46.99,14.61 IC7.7 | v31.75,14.61 31.75,14.71 | IC3.7 5.08,14.61 6.83,14.61 v16.51,14.61 19.05,14.61 | IC4.3 26.04,59.05 27.94,60.96 28.57,60.96 | 28.57,60.96 34.6,60.96 36.2,59.37 | VREG1.2 11.3,69.98 13.97,67.31 27.3,67.31 IC4.5 28.57,60.96 | JP1.2 5.08,72.39 6.99,74.3 8.76,74.3 VREG1.2 | JP3.2 55.24,72.39 59.05,76.84 v59.05,80.65 | v19.05,81.92 19.05,80.01 19.68,79.38 | 36.2,59.37 C8.1
  Bottom 0.762: 5.08,14.61 2.54,14.61 1.27,13.33 1.27,2.54 3.17,0.64 14.13,0.64 29.21,0.64 41.91,0.64 57.78,0.64 v59.05,1.91
HALT
  Top 0.254: IC5.18 49.21,32.7 49.21,34.61 CN1.18
INT
  Top 0.254: IC5.16 44.13,32.7 44.13,34.61 CN1.16
IORQ  (via drill 0.61)
  Top 0.254: v45.88,24.92 46.2,25.24 46.2,33.18 45.24,34.13 45.24,36.83 47.15,38.73 52.7,38.73 53.98,37.46 CN1.20 53.98,33.02 IC5.20
  Bottom 0.254: IC3.9 6.35,26.67 5.08,27.94 2.38,27.94 1.75,28.58 1.75,35.72 2.54,36.51 52.39,36.51 CN1.20 | IC7.9 48.26,25.4 46.35,25.4 v45.88,24.92
M1  (via drill 0.61)
  Top 0.254: v33.18,19.21 32.38,20 32.38,29.85 33.5,30.96 33.5,33.18 32.54,34.13 v32.54,44.61 | CN1.27 39.69,49.21 39.69,47.31 IC5.27
  Bottom 0.254: IC6.6 35.56,19.37 33.34,19.37 v33.18,19.21 | v32.54,44.61 33.81,45.88 38.89,45.88 IC5.27
MREQ
  Bottom 0.254: IC5.19 52.7,33.66 CN1.19
N$1  (via drill 0.61)
  Top 0.254: v14.29,25.56 12.86,26.99 12.86,30.64 13.18,30.96 13.18,33.18 12.22,34.13 12.22,38.42 12.86,39.05 12.86,43.97 v13.49,44.61
  Bottom 0.254: v14.29,25.56 17.62,25.56 19.05,24.13 IC2.8 | v13.49,44.61 13.49,48.26 14.29,49.05 19.21,49.05 19.84,49.69 19.84,51.59 20.32,52.07 32.38,52.07 32.86,52.55 55.72,52.55 58.42,55.24 58.42,66.36 57.63,67.15 52.55,67.15 IC1.12
N$2  (via drill 0.61)
  Top 0.254: SJ1.2 52.07,20.96 52.07,16.35 v51.75,16.03 | v48.9,14.92 46.04,12.06 46.04,9.37 42.23,5.56 38.73,5.56 38.26,5.08 31.27,5.08 27.94,8.41 IC10.31
  Bottom 0.254: v51.75,16.03 50.96,15.24 49.21,15.24 v48.9,14.92
N$3
  Bottom 0.508: C7.+ 15.79,76.61 R11.1 13.65,78.43 12.06,76.84 12.06,74.17 VREG1.3
N$6  (via drill 0.6)
  Top 0.254: v42.55,71.12 43.5,72.08 R7.1 46.67,72.08 46.99,71.76 46.99,70.48 v48.9,68.58 | v38.1,71.76 36.52,71.76 R5.1
  Bottom 0.254: v42.55,71.12 38.73,71.12 v38.1,71.76 | IC1.14 v48.9,68.58
N$7  (via drill 0.6)
  Top 0.254: IC4.2 30.48,65.41 30.48,67.31 31.75,68.58 41.27,68.58 v42.55,69.85 | v48.26,70.48 52.7,74.93 v52.7,78.11
  Bottom 0.254: 23.5,60.64 C14.1 23.18,58.74 IC4.2 | C2.- 49.62,79.61 R3.1 50.48,79.38 51.44,79.38 v52.7,78.11 | v48.26,70.48 43.18,70.48 v42.55,69.85
N$9
  Top 0.254: IC4.6 22.86,69.22 R1.1 23.18,72.08 25.4,69.85 38.1,69.85 39.37,71.12 39.37,76.52 R2.1
  Bottom 0.254: IC4.6 25.71,65.72 C16.1
N$11  (via drill 0.6)
  Top 0.254: R4.2 25.09,81.92 48.9,81.92 50.16,80.65 50.16,74.93 v47.62,72.39
  Bottom 0.254: v47.62,72.39 45.49,72.39 C1.-
N$12
  Top 0.254: R5.2 C3.2 R10.1
N$13  (via drill 0.6)
  Top 0.254: R6.1 33.34,72.08 v33.66,71.76 | R8.2 v40.64,69.85
  Bottom 0.254: v33.66,71.76 35.56,69.85 v40.64,69.85 41.27,69.85 43.81,67.31 IC1.15
N$14
  Top 0.254: C4.1 R9.1 26.35,73.98 25.4,73.03 25.4,71.12 26.04,70.48 28.57,70.48 30.48,72.39 30.48,73.66 31.11,74.3 31.43,74.3 R6.2
N$15  (via drill 0.61)
  Top 0.254: v6.35,19.69 6.03,20 6.03,22.7 v9.68,26.35 | v16.67,24.45 v14.29,26.83
  Bottom 0.254: v6.35,19.69 IC3.6 | v9.68,26.35 10.16,26.83 v14.29,26.83 | v16.67,24.45 18.57,22.54 23.34,22.54 24.13,23.34 IC2.12
N$16  (via drill 0.6)
  Top 0.254: R9.2 28.89,72.08 29.84,73.03 29.84,78.11 31.11,79.38 31.43,79.38 R10.2 32.07,80.01 v33.66,80.01
  Bottom 0.254: C2.+ 43.41,76.61 43.18,76.84 43.18,81.28 42.55,81.92 35.56,81.92 v33.66,80.01
N$17  (via drill 0.61)
  Top 0.254: v14.13,15.72 17.78,12.06 20.32,12.06 20.64,12.38 20.64,13.81 23.34,16.51 26.83,16.51 v26.83,19.69
  Bottom 0.254: IC3.4 8.89,16.51 9.68,15.72 v14.13,15.72 | v26.83,19.69 26.51,19.37 26.19,19.37 25.4,18.57 IC2.2
N$18  (via drill 0.61)
  Top 0.254: v6.99,21.59 8.57,20 v8.57,13.49 | v26.83,13.49 27.78,14.45 v27.78,16.83
  Bottom 0.254: IC3.8 5.08,22.23 5.71,21.59 v6.99,21.59 | v8.57,13.49 8.73,13.65 19.05,13.65 19.37,13.97 26.35,13.97 v26.83,13.49 | v27.78,16.83 26.83,17.78 26.67,17.78 IC2.1
N$19  (via drill 0.61)
  Top 0.254: v27.62,6.98 v31.11,3.49
  Bottom 0.254: v31.11,3.49 32.38,3.49 33.02,4.13 IC8.4 | v27.62,6.98 27.3,6.67 24.92,6.67 D1.A 24.77,6.67 24.29,7.14 20.48,7.14 R15.2 20.32,7.46 20,7.78 11.11,7.78 10.16,6.83 C9.+
N$20
  Top 0.254: IC10.25 23.5,15.88 23.5,15.08 21.11,12.7 21.11,6.98 16.51,2.38 6.83,2.38 5.4,3.81 5.4,11.43 JP2.1
N$21  (via drill 0.61)
  Top 0.254: IC10.23 23.18,18.42 v23.18,27.62 | v2.7,28.89 2.7,11.43 JP2.2
  Bottom 0.254: v23.18,27.62 21.91,28.89 v2.7,28.89
N$22  (via drill 0.61)
  Top 0.254: v43.02,9.37 45.24,9.37 45.56,9.68 45.56,12.22 44.45,12.22 R17.2 | v47.47,9.37 50.64,6.19 52.55,6.19 54.61,8.26 54.61,11.05 JP4.2 54.93,11.43 | v50.8,14.29 SJ1.1
  Bottom 0.254: v47.47,9.37 v43.02,9.37 | v50.8,14.29 53.66,11.43 JP4.2
N$24  (via drill 0.61)
  Top 0.254: v40.16,20.48 39.53,21.11 v39.53,26.35
  Bottom 0.254: v40.16,20.48 50.16,20.48 50.8,19.84 IC7.4 | v39.53,26.35 38.1,24.92 IC6.11
N$25  (via drill 0.61)
  Top 0.254: v48.9,13.65 48.9,12.06 49.53,11.43 SJ2.2 | v29.84,13.02 31.75,11.11 IC10.2
  Bottom 0.254: v48.9,13.65 30.48,13.65 v29.84,13.02
N$27
  Top 0.254: IC4.7 20.95,68.58 20.95,72.39 22.54,73.98 R1.2 R4.1
  Bottom 0.254: IC4.7 23.82,65.72 C16.2
N$30
  Bottom 0.254: IC6.12 39.37,25.4 45.09,25.4 45.56,25.88 48.58,25.88 49.53,24.92 IC7.10
N$31  (via drill 0.61)
  Top 0.254: v39.53,3.02 43.66,3.02 46.35,5.71 54.29,5.71 56.2,7.62 v56.2,16.19
  Bottom 0.254: v39.53,3.02 34.92,3.02 34.29,3.65 IC8.3 | v56.2,16.19 54.61,17.78 IC7.1
N$32  (via drill 0.61)
  Top 0.254: v50.96,7.14 53.5,9.68 v53.5,25.88
  Bottom 0.254: v50.96,7.14 46.35,7.14 45.72,6.51 IC9.4 | v53.5,25.88 53.5,24.13 53.34,24.13 IC7.13
N$33  (via drill 0.61)
  Top 0.254: v52.55,15.08 52.7,15.24 52.7,24.29 v51.12,25.88
  Bottom 0.254: IC6.8 34.29,29.21 36.35,31.27 36.35,32.86 48.42,32.86 49.05,32.23 49.05,26.35 50.24,25.16 | 50.24,25.16 50.8,24.61 IC7.11 | IC7.2 53.34,15.08 v52.55,15.08 | v51.12,25.88 50.48,25.24 50.32,25.24 50.24,25.16
N$38  (via drill 0.61)
  Top 0.254: v28.1,3.81 29.84,2.06 v37.94,2.06 | v49.21,3.33 48.26,2.38 46.99,2.38 v46.04,3.33
  Bottom 0.254: v28.1,3.81 16.19,3.81 R14.2 | v37.94,2.06 39.85,2.06 40.64,2.86 40.64,6.35 40.96,6.67 42.39,6.67 43.18,5.87 IC9.6 43.18,4.6 43.97,3.81 45.56,3.81 v46.04,3.33 | IC9.1 49.53,3.33 v49.21,3.33
N$40  (via drill 0.6)
  Top 0.254: R2.2 R18.1 46.67,79.69 v48.26,78.11 48.26,80.01 v47.62,80.65 | IC4.1 20.95,59.05 27.3,65.41 27.3,66.68 v24.13,69.85
  Bottom 0.254: 20.95,60.64 C14.2 21.27,58.74 IC4.1 | v48.26,78.11 49.21,77.16 R3.2 | v24.13,69.85 24.13,79.38 27.3,82.55 45.72,82.55 v47.62,80.65
N$41  (via drill 0.61)
  Top 0.254: v39.05,4.6 38.89,4.45 38.89,3.65 38.58,3.33 38.58,2.7 39.21,2.06 43.5,2.06 45.72,4.29 47.31,4.29 v47.94,3.33
  Bottom 0.254: v39.05,4.6 39.05,6.19 38.26,6.98 32.38,6.98 31.75,6.35 IC8.5 | v47.94,3.33 47.94,5.08 48.26,5.08 IC9.2
NMI
  Top 0.254: IC5.17 46.67,32.7 46.67,34.61 CN1.17
RD
  Top 0.254: CN1.21 55.24,48.89 IC5.21
  Bottom 0.254: IC7.12 52.07,26.67 57.63,32.23 57.63,45.09 55.72,46.99 IC5.21
RFSH
  Top 0.254: IC5.28 36.2,48.26 CN1.28
RST
  Top 0.254: IC5.26 41.59,47.94 41.59,49.85 CN1.26 41.43,50.16 41.43,50.48 42.39,51.43 42.39,59.53 IC1.13
SLT  (via drill 0.6)
  Top 0.254: R18.2 46.67,77.79 v48.26,76.2
  Bottom 0.254: v48.26,76.2 JP3.1
WAIT
  Top 0.254: IC5.24 46.35,48.26 CN1.24
WR  (via drill 0.61)
  Top 0.254: v57.78,20.48 56.67,21.59 v56.67,39.53 | 52.47,49.13 52.7,48.89 IC5.22 | 52.47,49.13 CN1.22 | IC1.11 52.55,64.61 52.55,49.21 52.47,49.13
  Bottom 0.254: v57.78,20.48 52.7,20.48 52.07,19.84 IC7.3 | v56.67,39.53 52.7,43.5 IC5.22

### Text on the board
tNames: 4.7k | 22pF | 22k | 22pF | 22k | JP1 | JP3 | PWR | OUT | R4 | C4 | R10 | C3 | R2 | +12 | GND | -12 | VREG1 | 22k | 22k | 2.2k | 2.2k | 2.2k | 2.2k | SLT | GND | AMP | R1 | R9 | R6 | R5 | R8 | R7 | 78L05 | +12 | GND | -12 | SLT | GND | AMP | 47uF | 47uF | + | AMP | OPLL | IC4 | LM4558 | IC1 | YM2413 | + | C6 | C5 | RBSC | 2018 | DIP40 MB CONNECTOR | CN1 | Version 1.5 | Russian Bear Service Crew | 2018 | IC5 | Z80 CPU | SJ1 & SJ2: 1-2 for 27c128, 27c256 | SJ1 & SJ2: 2-3 for 27c512 | For 27c512 connect OE to RD | F4/FMPAC Combo Board | CFG / JUMPERS | SJ1 | 3 | 2 | EPROM | 27c128 | 1 | JP2 | CE/OE | 27c256 | JP4 | ROMSEL | IC10 | 27c512 | SJ2 | 10k | 3 | R17 | 2 | 1 | CE | OE | Optional ROM | Selection | And Connectors | ROM | SLTSEL | CS1/RD | 27c256
bNames: 68 | 1uF | 2.2uF | 170k | C7 | C2 | RBSC | R11 | + | + | R3 | Russian Bear | 1uF | Service Crew | 2.2uF | 2.2uF | Version 1.5 | C1 | + | + | (C) 2018 | 100 | 100 | C8 | R12 | R13 | 470pF | C16 | C14 | 470pF | Optional | 100nF | F4/FMPAC Combo Board | F4 Port schematics by Caro (2011) | FMPAC mono schematics by Jipe (2010) | Board design and improvements by RBSC (2018) | IC3 | IC2 | IC6 | IC7 | 74LS04 | 74LS30 | 74LS30 | 74LS02 | 100nF | 10uF | C11 | 4.7k | C9 | R15 | D1 | IC8 | IC9 | 1k | 74LS74 | R14 | 74LS125 | + | 1N4148 | Optional MSX2+ F4 Port